# EAGLE schematic FULLMONI-WIDE_IF-Board1_SCH (EAGLE 9.7.0)
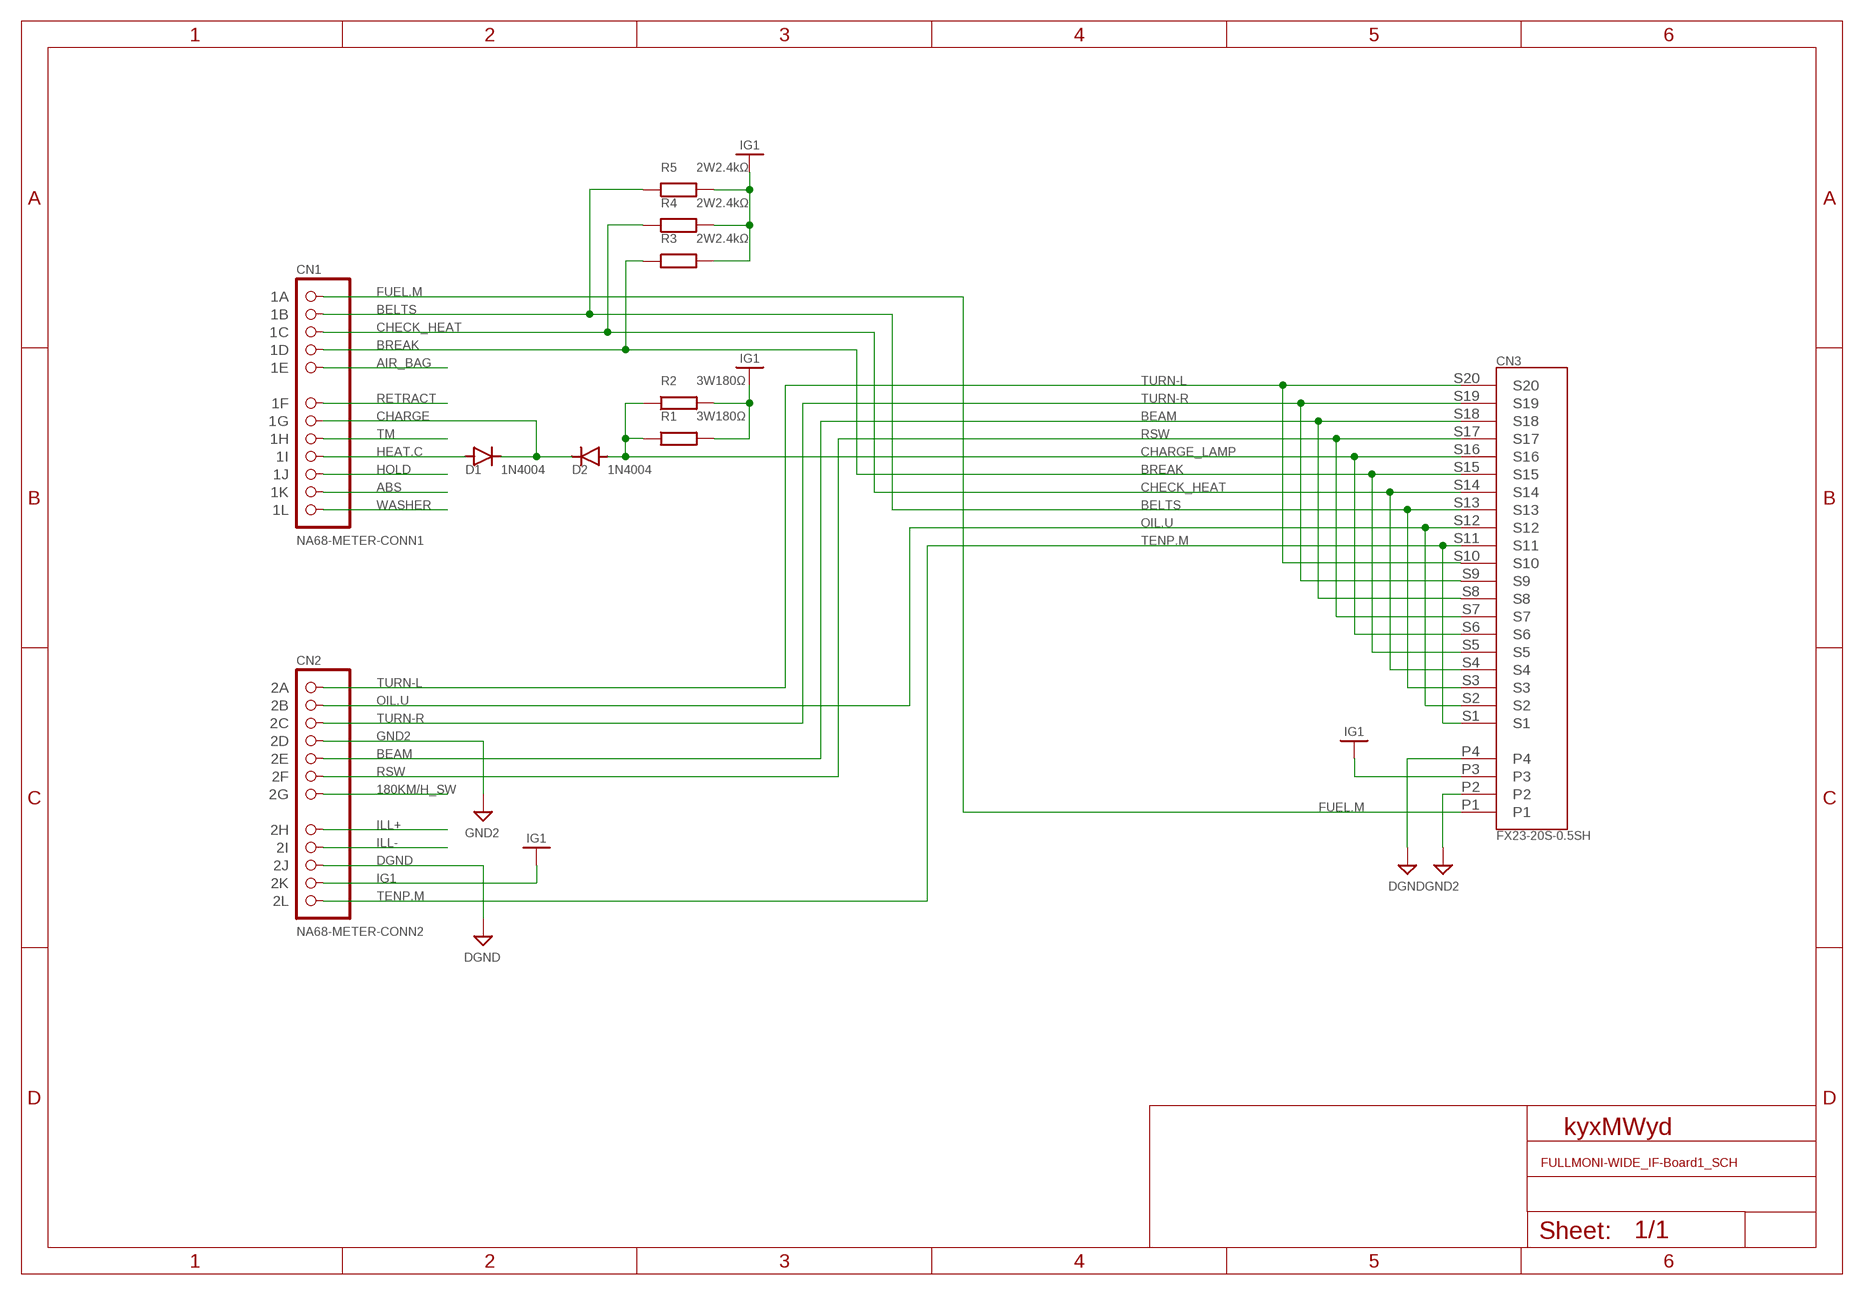
[diagram p0: schematic, sheet 1]

## Parts
CN1  NA68-METER-CONN1  [NA68-METER-CONN1]
CN2  NA68-METER-CONN2  [NA68-METER-CONN2]
CN3  FX23-20S-0.5SH  [FX23-20S-0.5SH]
D1  1N4004  [DO41-10]
D2  1N4004  [DO41-10]
R1  3W180Ω  R-EU_0617/17  [0617/17]
R2  3W180Ω  R-EU_0617/17  [0617/17]
R3  2W2.4kΩ  RLF2SJ  [RLF2SJ]
R4  2W2.4kΩ  RLF2SJ  [RLF2SJ]
R5  2W2.4kΩ  RLF2SJ  [RLF2SJ]

## Nets
180KM/H_SW: CN2.P$7(2G)
ABS: CN1.P$11(1K)
AIR_BAG: CN1.P$5(1E)
BEAM: CN2.P$5(2E) CN3.S8 CN3.S18
BELTS: CN1.P$2(1B) CN3.S3 CN3.S13 R5.1
BREAK: CN1.P$4(1D) CN3.S5 CN3.S15 R3.1
CHARGE: CN1.P$7(1G) D1.C D2.C
CHARGE_LAMP: CN3.S6 CN3.S16 D2.A R1.1 R2.1
CHECK_HEAT: CN1.P$3(1C) CN3.S4 CN3.S14 R4.1
DGND: CN2.P$10(2J) CN3.P4
FUEL.M: CN1.P$1(1A) CN3.P1
GND2: CN2.P$4(2D) CN3.P2
HEAT.C: CN1.P$9(1I) D1.A
HOLD: CN1.P$10(1J)
IG1: CN2.P$11(2K) CN3.P3 R1.2 R2.2 R3.2 R4.2 R5.2 ; supply symbol labelled +V
ILL+: CN2.P$8(2H)
ILL-: CN2.P$9(2I)
OIL.U: CN2.P$2(2B) CN3.S2 CN3.S12
RETRACT: CN1.P$6(1F)
RSW: CN2.P$6(2F) CN3.S7 CN3.S17
TENP.M: CN2.P$12(2L) CN3.S1 CN3.S11
TM: CN1.P$8(1H)
TURN-L: CN2.P$1(2A) CN3.S10 CN3.S20
TURN-R: CN2.P$3(2C) CN3.S9 CN3.S19
WASHER: CN1.P$12(1L)

## Library data of the parts
CN1 = ECADライブラリ:NA68-METER-CONN1
CN2 = ECADライブラリ:NA68-METER-CONN2
CN3 = ECADライブラリ:FX23-20S-0.5SH
D1 D2 = ECADライブラリ:1N4004: DIODE general purpose rectifier, 1 A
R1 R2 = ECADライブラリ:R-EU_: RESISTOR, European symbol; SPICEPREFIX: R
R3-R5 = ECADライブラリ:RLF2SJ